# EAGLE design ftdi_prototype (EAGLE 9.6.2)
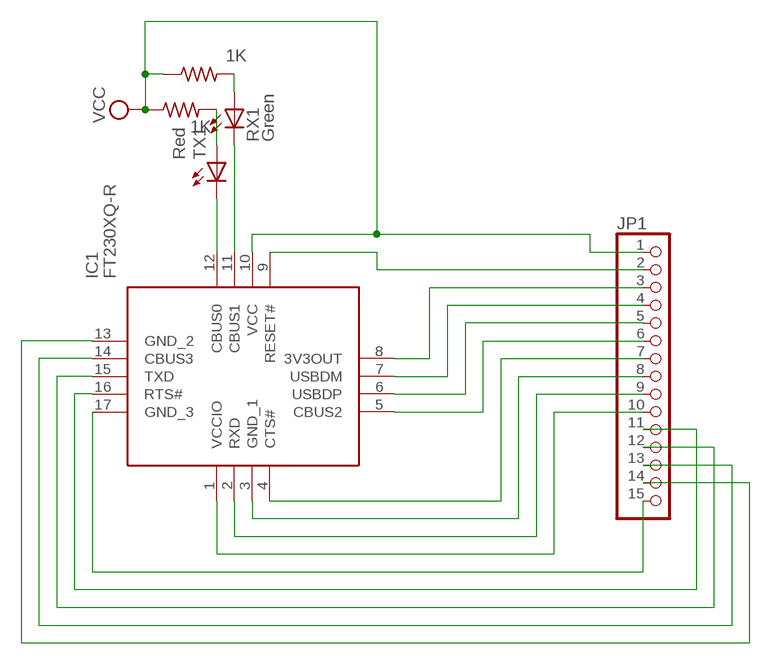
[diagram p0: schematic, sheet 1]

## Parts
IC1  FT230XQ-R  [QFN65P400X400X80-17N]
JP1  PINHD-1X15  [1X15]
R4  1K  R-US_R0805  [R0805]
R5  1K  R-US_R0805  [R0805]
RX1  Green  LEDCHIP-LED0805  [CHIP-LED0805]
TX1  Red  LEDCHIP-LED0805  [CHIP-LED0805]

## Nets
N$1: IC1.9(RESET#) JP1.2
N$3: IC1.5(CBUS2) JP1.6
N$4: IC1.6(USBDP) JP1.5
N$5: IC1.7(USBDM) JP1.4
N$6: IC1.8(3V3OUT) JP1.3
N$7: R4.2 RX1.A
N$8: R5.2 TX1.A
N$9: IC1.11(CBUS1) RX1.C
N$10: IC1.12(CBUS0) TX1.C
N$11: IC1.4(CTS#) JP1.7
N$12: IC1.3(GND_1) JP1.8
N$13: IC1.2(RXD) JP1.9
N$14: IC1.1(VCCIO) JP1.10
N$15: IC1.17(GND_3) JP1.15
N$16: IC1.16(RTS#) JP1.11
N$17: IC1.15(TXD) JP1.12
N$18: IC1.14(CBUS3) JP1.13
N$19: IC1.13(GND_2) JP1.14
VCC: IC1.10(VCC) JP1.1 R4.1 R5.1

## Library data of the parts
IC1 = SamacSys_Parts:FT230XQ-R: X-Chip USB to Basic UART Interface FTDI Chip FT230XQ-R UART Interface 3MBd, 5 V, 16-Pin, QFN Source: Datasheet <https://componentsearchengine.com/Datasheets/1/FT230XQ-R.pdf>; DESCRIPTION: X-Chip USB to Basic UART Interface FTDI Chip FT230XQ-R UART Interface 3MBd, 5 V, 16-Pin, QFN; HEIGHT: 0.8mm; MANUFACTURER_NAME: FTDI Chip; MANUFACTURER_PART_NUMBER: FT230XQ-R; MOUSER_PART_NUMBER: 895-FT230XQ-R; MOUSER_PRICE-STOCK: https://www.mouser.co.uk/ProductDetail/FTDI/FT230XQ-R?qs=Gp1Yz1mis3VvmXwyDmIHOg%3D%3D
JP1 = pinhead:PINHD-1X15: PIN HEADER
R4 R5 = adafruit:R-US_: RESISTOR, American symbol
RX1 TX1 = adafruit:LED: LED OSRAM: - CHIPLED LG R971, LG N971, LY N971, LG Q971, LY Q971, LO R971, LY R971 LH N974, LH R974 LS Q976, LO Q976, LY Q976 LO Q996 - Hyper CHIPLED LW Q18S LB Q993, LB Q99A, LB R99A - SideLED LS A670, LO A670, LY A670, LG A670, LP A670 LB A673, LV A673, LT A673, LW A673 LH A674 LY A675 LS A676, LA A676, LO A676, LY A676, LW A676 LS A679, LY A679, LG A679 - Hyper Micro SIDELED® LS Y876, LA Y876, LO Y876, LY Y876 LT Y87S - SmartLED LW L88C, LW L88S LB L89C, LB L89S, LG L890 LS L89K, LO L89K, LY L89K LS L896, LA L896, LO L896, LY L896 - TOPLED LS T670, LO T670, LY T670, LG T670, LP T670 LSG T670, LSP T670, LSY T670, LOP T670, LYG T670 LG T671, LOG T671, LSG T671 LB T673, LV T673, LT T673, LW T673 LH T674 LS T676, LA T676, LO T676, LY T676, LB T676, LH T676, LSB T676, LW T676 LB T67C, LV T67C, LT T67C, LS T67K, LO T67K, LY T67K, LW E67C LS E67B, LA E67B, LO E67B, LY E67B, LB E67C, LV E67C, LT E67C LW T67C LS T679, LY T679, LG T679 LS T770, LO T770, LY T770, LG T770, LP T770 LB T773, LV T773, LT T773, LW T773 LH T774 LS E675, LA E675, LY E675, LS T675 LS T776, LA T776, LO T776, LY T776, LB T776 LHGB T686 LT T68C, LB T68C - Hyper Mini TOPLED® LB M676 - Mini TOPLED Santana® LG M470 LS M47K, LO M47K, LY M47K Source: http://www.osram.convergy.de/

## Board
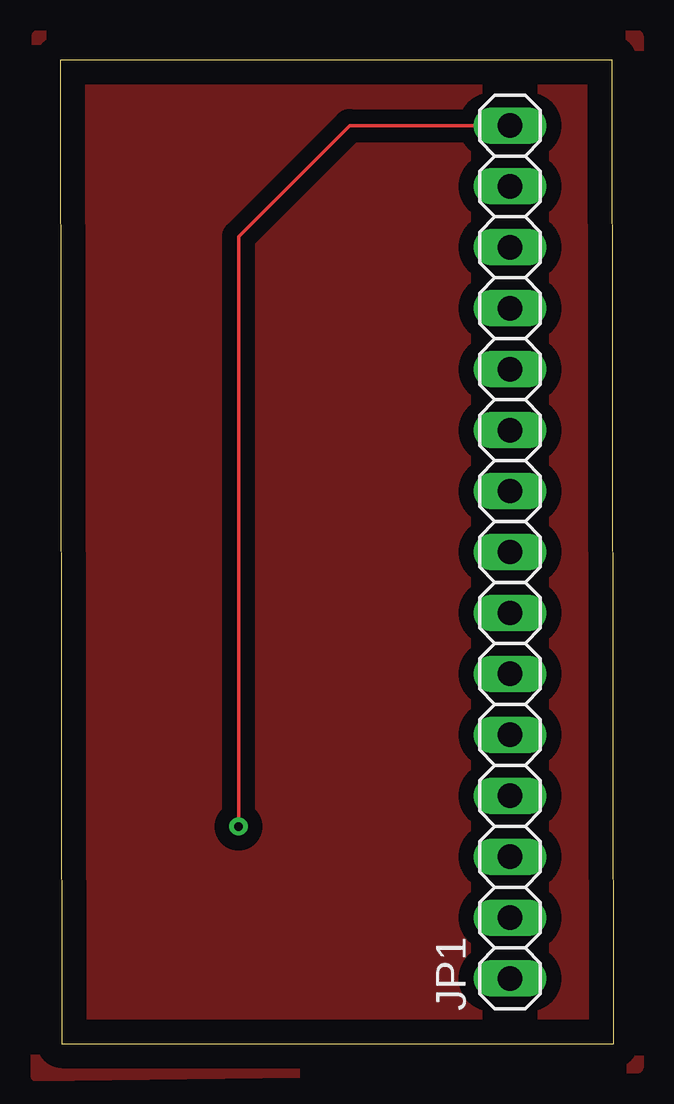
[diagram p1: board, top side]
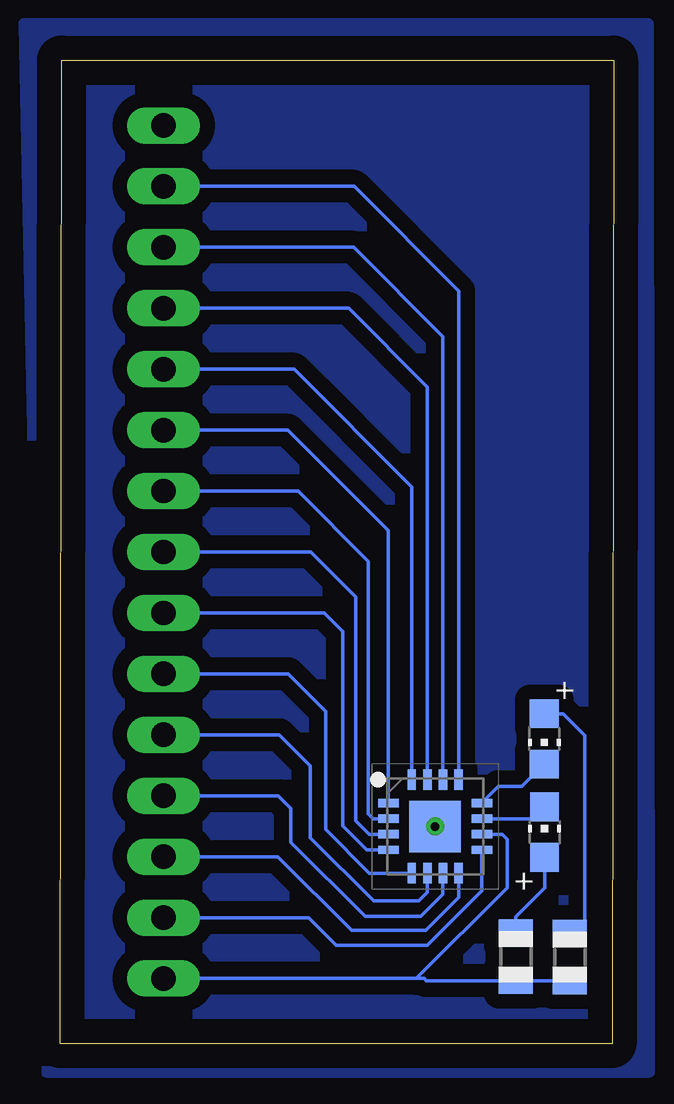
[diagram p2: board, bottom side, seen from below]

Size 23.07 x 41 mm. Coordinates in mm from the lower left corner, seen from the top.
Outline: 0.07,0 23.07,0 23,41 0,41 0.07,0
Copper layers (1*16): Top 0.035mm / dielectric 1.5mm / Bottom 0.035mm
Design rules "default": minimum track width 6mil, minimum drill 0.35mm, track to track 6mil, track to pad 6mil, pad to pad 6mil, via to via 6mil, smd to smd 6mil, copper to edge 40mil, drill to drill 6mil, minimum pad ring 10mil, minimum via ring 8mil, stop-mask expansion 4mil, vias tented up to drill 0mil, thermal gap 10mil

### Footprints (pad centres in the part's own frame; a part is rotated, then mirrored left to right if it is on the bottom)
QFN65P400X400X80-17N = smd 0.85 x 0.35: 1 -1.95,0.975; 2 -1.95,0.325; 3 -1.95,-0.325; 4 -1.95,-0.975; 9 1.95,-0.975; 10 1.95,-0.325; 11 1.95,0.325; 12 1.95,0.975 | smd 0.35 x 0.85: 5 -0.975,-1.95; 6 -0.325,-1.95; 7 0.325,-1.95; 8 0.975,-1.95; 13 0.975,1.95; 14 0.325,1.95; 15 -0.325,1.95; 16 -0.975,1.95 | smd 2.15 x 2.15: 17 0,0
1X15 = drill 1.016 long: 1 -17.78,0; 2 -15.24,0; 3 -12.7,0; 4 -10.16,0; 5 -7.62,0; 6 -5.08,0; 7 -2.54,0; 8 0,0; 9 2.54,0; 10 5.08,0; 11 7.62,0; 12 10.16,0; 13 12.7,0; 14 15.24,0; 15 17.78,0
R0805 = smd 1.1 x 1.4: 1 -1,0; 2 1,0
CHIP-LED0805 = smd 1.2 x 1.2: A 0,-1.05; C 0,1.05

### Placement (x,y rotation side)
IC1  7.44,9.05 0 bottom
JP1  18.75,20.49 90 top
R4  4.08,3.62 90 bottom
R5  1.83,3.61 90 bottom
RX1  2.88,8.81 0 bottom
TX1  2.89,12.7 180 bottom

### Tracks (layer width: path | path; a pad name or v marks a point on that pad's centre or on a via)
GND
  pour Bottom (isolate 0.61): -1.43,42.5 24.57,42.5 23.65,-1.17 -1.49,-1.17
N$1
  Bottom 0.152: IC1.9 5.49,6.36 7.76,4.09 11.55,4.09 12.71,5.25 JP1.2
N$3
  Bottom 0.152: IC1.5 10.18,7.1 12,8.92 12,13.85 13.56,15.41 JP1.6
N$4
  Bottom 0.152: IC1.6 7.77,6.3 8.13,5.94 10,5.94 12.64,8.58 12.64,11.57 13.94,12.87 JP1.5
N$5
  Bottom 0.152: IC1.7 7.12,6.22 8.04,5.3 10.36,5.3 13.45,8.39 13.45,9.81 13.97,10.33 JP1.4
N$6
  Bottom 0.152: IC1.8 6.46,6.08 7.84,4.71 10.92,4.71 14,7.79 JP1.3
N$7
  Bottom 0.152: RX1.A 2.88,6.49 4.08,5.29 R4.2
N$8
  Bottom 0.152: R5.2 1.52,4.61 1.2,4.93 1.2,12.85 2.1,13.75 TX1.A
N$9
  Bottom 0.152: IC1.11 3.36,9.38 RX1.C
N$10
  Bottom 0.152: IC1.12 4.81,10.71 3.83,10.71 TX1.C
N$11
  Bottom 0.152: IC1.4 10.29,8.07 11.29,9.08 11.29,17.18 12.06,17.95 JP1.7
N$12
  Bottom 0.152: IC1.3 10.18,8.72 10.74,9.29 10.74,18.61 12.62,20.49 JP1.8
N$13
  Bottom 0.152: IC1.2 10.02,9.38 10.22,9.58 10.22,20.1 13.15,23.03 JP1.9
N$14
  Bottom 0.152: IC1.1 9.39,21.38 13.58,25.57 JP1.10
N$15  (via drill 0.35)
  Top 0.152: IC1.17 7.44,33.64 12.07,38.27 JP1.15
  other vias: 7.44,9.05
N$16
  Bottom 0.152: IC1.16 8.42,23.2 13.32,28.11 JP1.11
N$17
  Bottom 0.152: IC1.15 7.77,27.38 11.04,30.65 JP1.12
N$18
  Bottom 0.152: IC1.14 7.12,29.48 10.83,33.19 JP1.13
N$19
  Bottom 0.152: IC1.13 6.46,31.38 10.82,35.73 JP1.14
TOPSIGNAL
  pour Top (isolate 0.61): -0.93,42 24.07,42 24.07,-1 -0.98,-1.35
VCC
  Bottom 0.152: R5.1 R4.1 7.81,2.62 7.9,2.71 8.23,2.71 | IC1.10 4.65,8.72 4.44,8.52 4.44,6.5 8.23,2.71 | 8.23,2.71 JP1.1